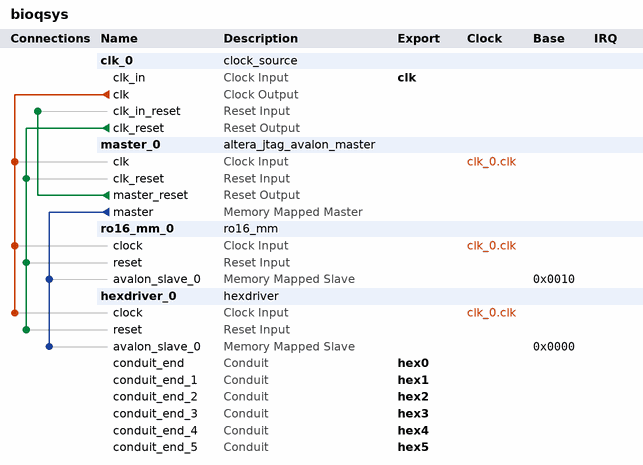
[diagram p0: system contents]
# Platform Designer (Qsys) system bioqsys, Cyclone V 5CSEMA5F31C6
# Parameters at their usual value, and those the tool derives, are not listed.
package require -exact qsys 17.1
create_system bioqsys
set_project_property DEVICE_FAMILY {Cyclone V}
set_project_property DEVICE 5CSEMA5F31C6

add_instance clk_0 clock_source 17.1
set_instance_parameter_value clk_0 clockFrequency 50000000

add_instance master_0 altera_jtag_avalon_master 17.1

add_instance ro16_mm_0 ro16_mm 1.0

add_instance hexdriver_0 hexdriver 1.0

# connections
add_connection clk_0.clk hexdriver_0.clock clock
add_connection clk_0.clk master_0.clk clock
add_connection clk_0.clk ro16_mm_0.clock clock
add_connection clk_0.clk_reset hexdriver_0.reset reset
add_connection clk_0.clk_reset master_0.clk_reset reset
add_connection clk_0.clk_reset ro16_mm_0.reset reset
add_connection master_0.master_reset clk_0.clk_in_reset reset
add_connection master_0.master hexdriver_0.avalon_slave_0 avalon
set_connection_parameter_value master_0.master/hexdriver_0.avalon_slave_0 baseAddress 0x0000
add_connection master_0.master ro16_mm_0.avalon_slave_0 avalon
set_connection_parameter_value master_0.master/ro16_mm_0.avalon_slave_0 baseAddress 0x0010

# exported interfaces
add_interface clk clock sink
set_interface_property clk EXPORT_OF clk_0.clk_in
add_interface hex0 conduit end
set_interface_property hex0 EXPORT_OF hexdriver_0.conduit_end
add_interface hex1 conduit end
set_interface_property hex1 EXPORT_OF hexdriver_0.conduit_end_1
add_interface hex2 conduit end
set_interface_property hex2 EXPORT_OF hexdriver_0.conduit_end_2
add_interface hex3 conduit end
set_interface_property hex3 EXPORT_OF hexdriver_0.conduit_end_3
add_interface hex4 conduit end
set_interface_property hex4 EXPORT_OF hexdriver_0.conduit_end_4
add_interface hex5 conduit end
set_interface_property hex5 EXPORT_OF hexdriver_0.conduit_end_5

set_interconnect_requirement {$system} qsys_mm.clockCrossingAdapter HANDSHAKE
set_interconnect_requirement {$system} qsys_mm.enableEccProtection FALSE
set_interconnect_requirement {$system} qsys_mm.insertDefaultSlave FALSE
set_interconnect_requirement {$system} qsys_mm.maxAdditionalLatency 1

save_system bioqsys.qsys
